# EAGLE schematic E (EAGLE 9.6.2)
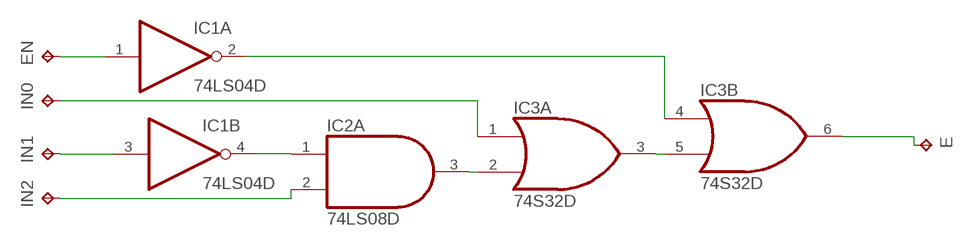
[diagram p0: schematic, sheet 1]

## Parts
E  TPB1,27  [B1,27]
EN  TPB1,27  [B1,27]
IC1  74LS04D  [SO14]
IC2  74LS08D  [SO14]
IC3  74S32D  [SO14]
IN0  TPB1,27  [B1,27]
IN1  TPB1,27  [B1,27]
IN2  TPB1,27  [B1,27]

## Nets
N$1: EN.TP IC1.1(A:I)
N$2: IC1.3(B:I) IN1.TP
N$3: IC2.2(A:I1) IN2.TP
N$4: IC1.4(B:O) IC2.1(A:I0)
N$5: IC2.3(A:O) IC3.2(A:I1)
N$6: IC3.1(A:I0) IN0.TP
N$7: IC3.3(A:O) IC3.5(B:I1)
N$8: IC1.2(A:O) IC3.4(B:I0)
N$9: E.TP IC3.6(B:O)
Unconnected: IC1.5(C:I) IC1.6(C:O) IC1.8(D:O) IC1.9(D:I) IC1.10(E:O) IC1.11(E:I) IC1.12(F:O) IC1.13(F:I) IC2.4(B:I0) IC2.5(B:I1) IC2.6(B:O) IC2.8(C:O) IC2.9(C:I0) IC2.10(C:I1) IC2.11(D:O) IC2.12(D:I0) IC2.13(D:I1) IC3.8(C:O) IC3.9(C:I0) IC3.10(C:I1) IC3.11(D:O) IC3.12(D:I0) IC3.13(D:I1)

## Power pins joined to a net without a drawn wire
GND: IC1.7(P:GND) IC2.7(P:GND) IC3.7(P:GND)
VCC: IC1.14(P:VCC) IC2.14(P:VCC) IC3.14(P:VCC)

## Library data of the parts
E EN IN0 IN1 IN2 = testpad:TP: Test pad
IC1 = 74xx-us:74*04: Hex INVERTER
IC2 = 74xx-us:74*08: Quad 2-input AND gate
IC3 = 74xx-us:74*32: Quad 2-input OR gate